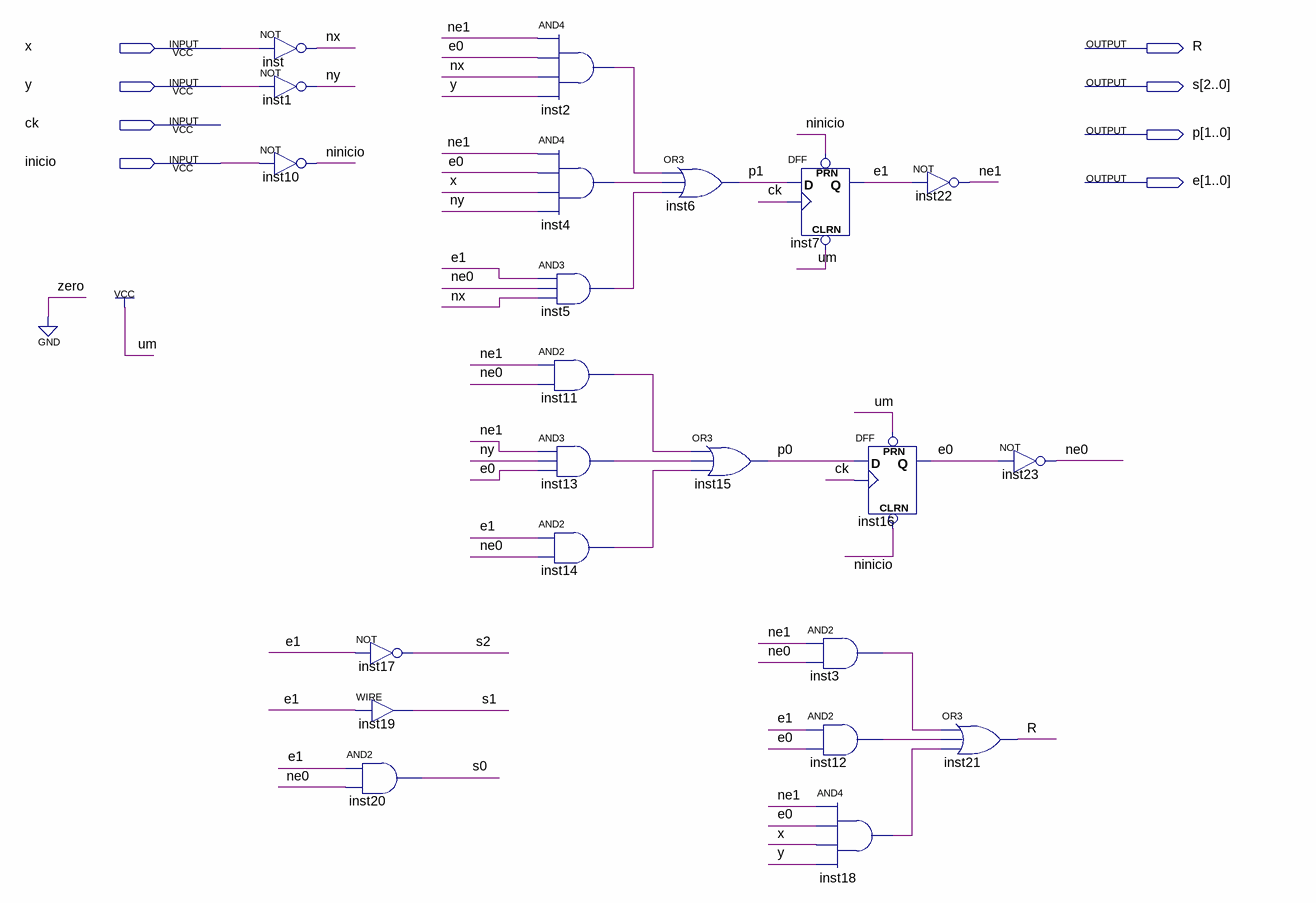
[diagram p0: schematic sheet]
// Quartus schematic jpd_fsm.bdf as structural Verilog: 22 symbols, 8 pins
module jpd_fsm (
  input  x,
  input  y,
  input  ck,
  input  inicio,
  output R,
  output [2:0] s,
  output [1:0] p,
  output [1:0] e
);

  wire inst2_out, inst3_out, inst4_out, inst5_out, inst11_out, inst12_out, inst13_out, inst14_out,
       inst18_out, ne0, ne1, ninicio, nx, ny;

  not inst (nx, x);
  not inst1 (ny, y);
  not inst10 (ninicio, inicio);
  not inst17 (s[2], e[1]);
  assign s[1] = e[1];  // WIRE inst19
  and inst20 (s[0], e[1], ne0);
  and inst2 (inst2_out, ne1, e[0], nx, y);
  and inst4 (inst4_out, ne1, e[0], x, ny);
  and inst5 (inst5_out, e[1], ne0, nx);
  and inst11 (inst11_out, ne1, ne0);
  and inst13 (inst13_out, ne1, ny, e[0]);
  and inst14 (inst14_out, e[1], ne0);
  or inst6 (p[1], inst2_out, inst4_out, inst5_out);
  or inst15 (p[0], inst11_out, inst13_out, inst14_out);
  DFF inst7 (.CLRN(1'b1), .CLK(ck), .D(p[1]), .PRN(ninicio), .Q(e[1]));
  and inst3 (inst3_out, ne1, ne0);
  and inst12 (inst12_out, e[1], e[0]);
  and inst18 (inst18_out, ne1, e[0], x, y);
  DFF inst16 (.CLRN(ninicio), .CLK(ck), .D(p[0]), .PRN(1'b1), .Q(e[0]));
  not inst22 (ne1, e[1]);
  or inst21 (R, inst3_out, inst12_out, inst18_out);
  not inst23 (ne0, e[0]);
endmodule
